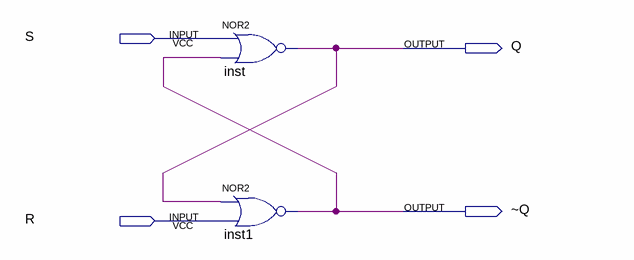
[diagram p0: schematic sheet]
// Quartus schematic lab09step0.bdf as structural Verilog: 2 symbols, 4 pins
module lab09step0 (
  input  S,
  input  R,
  output Q,
  output \~Q 
);

  nor inst (Q, S, \~Q );
  nor inst1 (\~Q , Q, R);
endmodule
